# EAGLE design simple ladder filter (EAGLE 9.6.2)
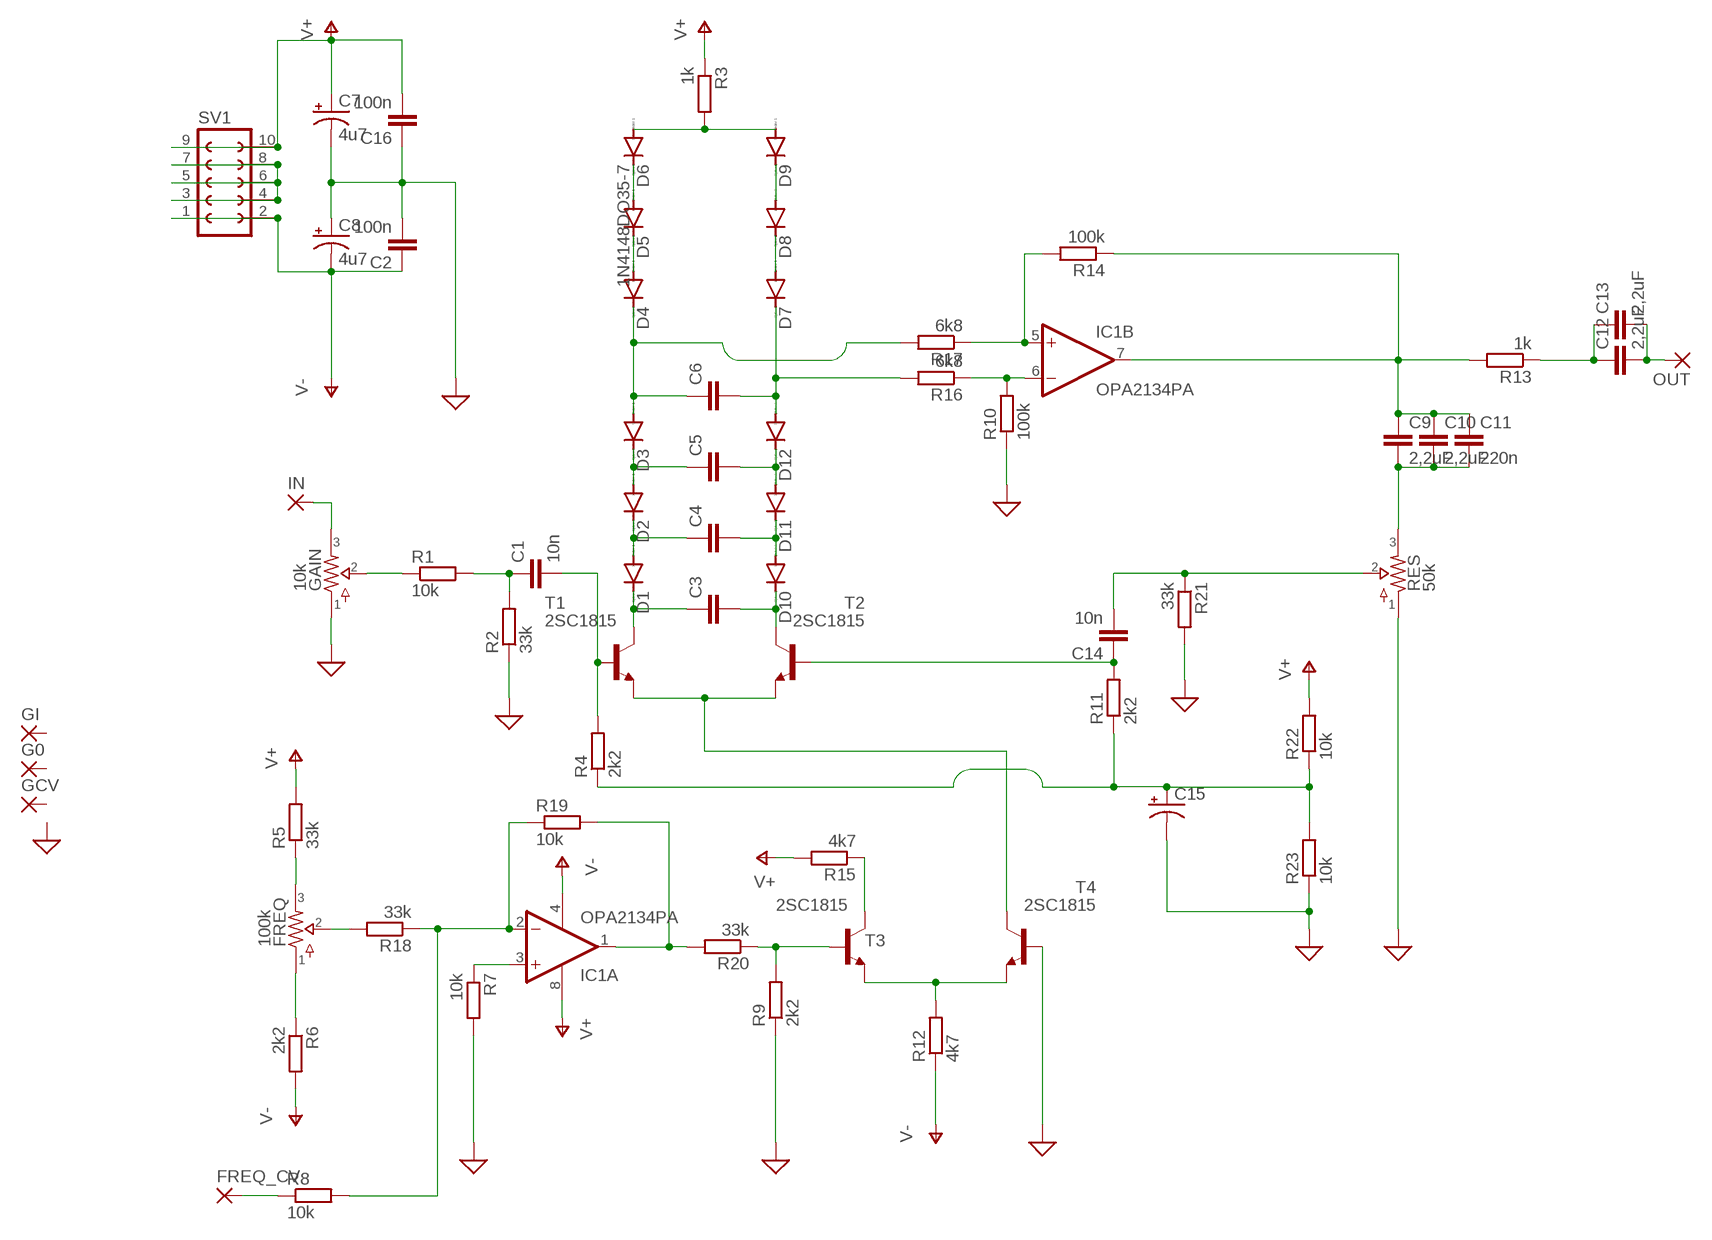
[diagram p0: schematic, sheet 1]

## Parts
C1  10n  C5/3  [C5B3]
C2  100n  C5/3  [C5B3]
C3  C2.5/2  [C2.5-2]
C4  C2.5/2  [C2.5-2]
C5  C2.5/2  [C2.5-2]
C6  C2.5/2  [C2.5-2]
C7  4u7  CPOL-USE2-4  [E2-4]
C8  4u7  CPOL-USE2-4  [E2-4]
C9  2,2uF  C5/5.5  [C5B5.5]
C10  2,2uF  C5/5.5  [C5B5.5]
C11  220n  C5/3  [C5B3]
C12  2,2uF  C5/5.5  [C5B5.5]
C13  2,2uF  C5/5.5  [C5B5.5]
C14  10n  C5/3  [C5B3]
C15  CPOL-USE2-4  [E2-4]
C16  100n  C5/3  [C5B3]
D1  1N4148DO35-7  [DO35-7]
D2  1N4148DO35-7  [DO35-7]
D3  1N4148DO35-7  [DO35-7]
D4  1N4148DO35-7  [DO35-7]
D5  1N4148DO35-7  [DO35-7]
D6  1N4148DO35-7  [DO35-7]
D7  1N4148DO35-7  [DO35-7]
D8  1N4148DO35-7  [DO35-7]
D9  1N4148DO35-7  [DO35-7]
D10  1N4148DO35-7  [DO35-7]
D11  1N4148DO35-7  [DO35-7]
D12  1N4148DO35-7  [DO35-7]
FREQ  100k  POTS9MM_VERT  [9MM_VERT]
FREQ_CV  1,6/0,9  [1,6/0,9]
G0  1,6/0,9  [1,6/0,9]
GAIN  10k  POTS9MM_VERT  [9MM_VERT]
GCV  1,6/0,9  [1,6/0,9]
GI  1,6/0,9  [1,6/0,9]
IC1  OPA2134PA  [DIL08]
IN  1,6/0,9  [1,6/0,9]
OUT  1,6/0,9  [1,6/0,9]
R1  10k  R-EU_0204/7  [0204/7]
R2  33k  R-EU_0204/7  [0204/7]
R3  1k  R-EU_0204/7  [0204/7]
R4  2k2  R-EU_0204/7  [0204/7]
R5  33k  R-EU_0204/7  [0204/7]
R6  2k2  R-EU_0204/7  [0204/7]
R7  10k  R-EU_0204/7  [0204/7]
R8  10k  R-EU_0204/7  [0204/7]
R9  2k2  R-EU_0204/7  [0204/7]
R10  100k  R-EU_0204/7  [0204/7]
R11  2k2  R-EU_0204/7  [0204/7]
R12  4k7  R-EU_0204/7  [0204/7]
R13  1k  R-EU_0204/7  [0204/7]
R14  100k  R-EU_0204/7  [0204/7]
R15  4k7  R-EU_0204/7  [0204/7]
R16  6k8  R-EU_0204/7  [0204/7]
R17  6k8  R-EU_0204/7  [0204/7]
R18  33k  R-EU_0204/7  [0204/7]
R19  10k  R-EU_0204/7  [0204/7]
R20  33k  R-EU_0204/7  [0204/7]
R21  33k  R-EU_0204/7  [0204/7]
R22  10k  R-EU_0204/7  [0204/7]
R23  10k  R-EU_0204/7  [0204/7]
RES  50k  POTS9MM_VERT  [9MM_VERT]
SV1  FE05-2  [FE05-2]
T1  2SC1815  [TO92-ECB]
T2  2SC1815  [TO92-ECB]
T3  2SC1815  [TO92-ECB]
T4  2SC1815  [TO92-ECB]

## Nets
GND: C2.2 C7.- C8.+ C15.- C16.1 GAIN.1 R2.1 R7.2 R9.1 R10.1 R21.2 R23.1 RES.1 T4.B ; supply symbol labelled SUP
N$1: GAIN.3 IN.1(P)
N$2: GAIN.2 R1.1
N$3: C1.1 R1.2 R2.2
N$4: C1.2 R4.2 T1.B
N$5: FREQ.3 R5.1
N$6: FREQ.1 R6.1
N$7: FREQ.2 R18.2
N$8: FREQ_CV.1(P) R8.1
N$9: IC1.2(A:-IN) R8.2 R18.1 R19.1
N$10: D7.A D8.C
N$11: C3.1 D1.C T1.C
N$12: C4.1 D1.A D2.C
N$13: C5.1 D2.A D3.C
N$14: C6.1 D3.A D4.C R17.2
N$15: D4.A D5.C
N$16: D5.A D6.C
N$17: D8.A D9.C
N$18: C6.2 D7.C D12.A R16.2
N$19: C5.2 D11.A D12.C
N$20: C4.2 D10.A D11.C
N$21: C3.2 D10.C T2.C
N$22: D6.A D9.A R3.2
N$23: IC1.3(A:+IN) R7.1
N$24: IC1.1(A:OUT) R19.2 R20.2
N$25: R9.2 R20.1 T3.B
N$26: R12.2 T3.E T4.E
N$27: IC1.6(B:-IN) R10.2 R16.1
N$28: T1.E T2.E T4.C
N$29: R15.1 T3.C
N$30: IC1.5(B:+IN) R14.2 R17.1
N$31: C15.+ R4.1 R11.1 R22.1 R23.2
N$32: C12.1 C13.1 R13.1
N$33: C12.2 C13.2 OUT.1(P)
N$34: C9.1 C10.1 C11.1 IC1.7(B:OUT) R13.2 R14.1
N$35: C9.2 C10.2 C11.2 RES.3
N$36: C14.1 R11.2 T2.B
N$38: C14.2 R21.1 RES.2
N$41: SV1.3 SV1.4 SV1.5 SV1.6 SV1.7 SV1.8
V+: C7.+ C16.2 IC1.8(A:V+) R3.1 R5.2 R15.2 R22.2 SV1.9 SV1.10
V-: C2.1 C8.- IC1.4(A:V-) R6.2 R12.1 SV1.1 SV1.2
Unconnected: G0.1(P) GCV.1(P) GI.1(P)

## Library data of the parts
C1-C6 C9-C14 C16 = capacitor-wima:C: CAPACITOR naming: grid - package width
C7 C8 C15 = adafruit:CPOL-US: POLARIZED CAPACITOR, American symbol
D1-D12 = diode:1N4148: DIODE high speed (Philips)
FREQ GAIN RES = potentiometers:POTS
FREQ_CV G0 GCV GI IN OUT = Electric Roots wirepad large drill:1,6/0,9: THROUGH-HOLE PAD
IC1 = linear:OPA2*: Dual Operational Amplifier Low Power, Single-Supply, Rail-To-Rail Operational Amplifier Source: http://focus.ti.com/lit/ds/symlink/opa2345.pdf http://focus.ti.com .. opa241.pdf http://focus.ti.com/lit/ds/symlink/opa2134.pdf
R1-R23 = rcl:R-EU_: RESISTOR, European symbol; SPICEPREFIX: R
SV1 = con-lsta:FE05-2: FEMALE HEADER; OC_FARNELL: unknown; OC_NEWARK: unknown
T1-T4 = transistor:2SC1815: NPN EPITAXIAL TRANSISTOR Source: TOSHIBA .. 2SC1815 1.pdf

## Board
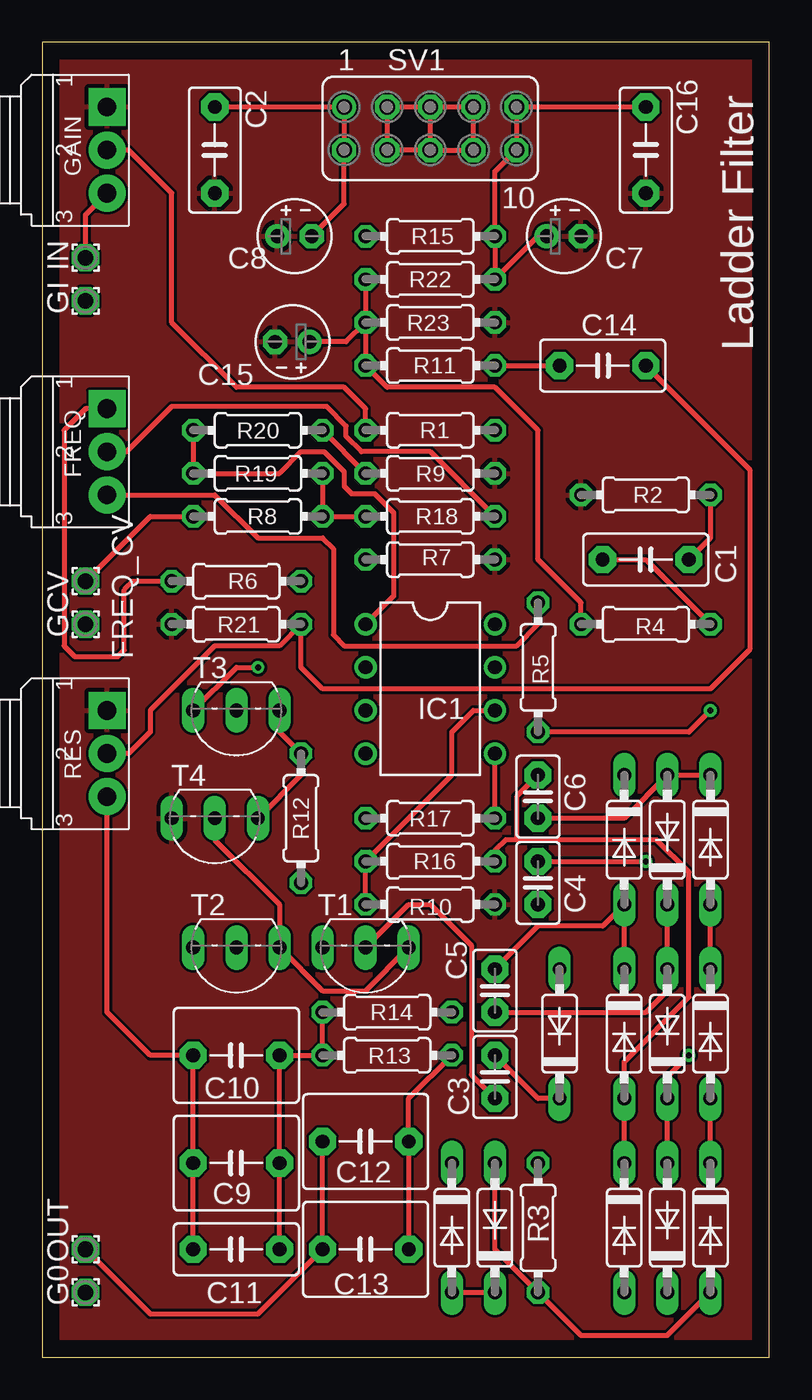
[diagram p1: board, top side]
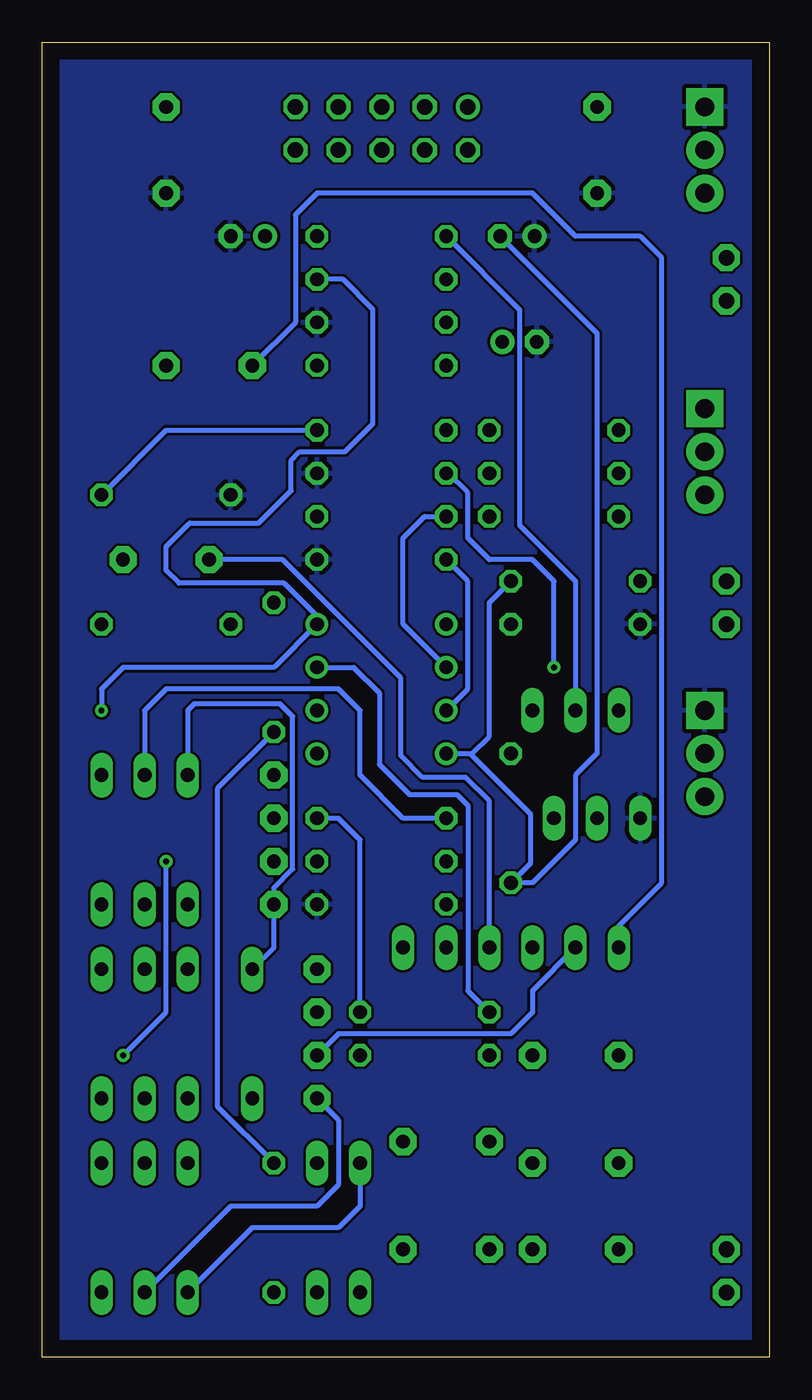
[diagram p2: board, bottom side, seen from below]

Size 42.85 x 77.46 mm. Coordinates in mm from the lower left corner, seen from the top.
Outline: 0,0 42.85,0 42.85,77.46 0,77.46 0,0
Copper layers (1*16): Top 0.035mm / dielectric 1.5mm / Bottom 0.035mm
Design rules "default": minimum track width 6mil, minimum drill 0.35mm, track to track 6mil, track to pad 6mil, pad to pad 6mil, via to via 6mil, smd to smd 6mil, copper to edge 40mil, drill to drill 6mil, minimum pad ring 10mil, minimum via ring 8mil, stop-mask expansion 4mil, vias tented up to drill 0mil, thermal gap 10mil

### Footprints (pad centres in the part's own frame; a part is rotated, then mirrored left to right if it is on the bottom)
C5B3 = drill 0.813 pad 1.6 octagon: 1 -2.54,0; 2 2.54,0
C2.5-2 = drill 0.813 pad 1.6 octagon: 1 -1.27,0; 2 1.27,0
E2-4 = drill 0.813 pad 1.422: + -1.016,0 | drill 0.813 pad 1.422 octagon: - 1.016,0
C5B5.5 = drill 0.813 pad 1.6 octagon: 1 -2.54,0; 2 2.54,0
DO35-7 = drill 0.813 long: A 3.81,0; C -3.81,0
9MM_VERT = drill 1.1 pad 2.184 square: 1 2.54,0 | drill 1.1 pad 2.184: 2 0,0; 3 -2.54,0
1,6/0,9 = drill 0.914 pad 1.6 octagon: 1 0,0
DIL08 = drill 0.813 pad 1.27: 1 -3.81,-3.81; 2 -1.27,-3.81; 3 1.27,-3.81; 4 3.81,-3.81; 5 3.81,3.81; 6 1.27,3.81; 7 -1.27,3.81; 8 -3.81,3.81
0204/7 = drill 0.813 octagon: 1 -3.81,0; 2 3.81,0
FE05-2 = drill 0.914: 1 -5.08,1.27 | drill 0.914 octagon: 2 -5.08,-1.27; 3 -2.54,1.27; 4 -2.54,-1.27; 5 0,1.27; 6 0,-1.27; 7 2.54,1.27; 8 2.54,-1.27; 9 5.08,1.27; 10 5.08,-1.27
TO92-ECB = drill 0.813 long: B 2.54,0; C 0,0; E -2.54,0

### Placement (x,y rotation side)
C1  35.56,46.99 180 top
C2  10.16,71.12 270 top
C3  26.67,16.51 90 top
C4  29.21,27.94 270 top
C5  26.67,21.59 90 top
C6  29.21,33.02 90 top
C7  30.73,66.04 0 top
C8  14.86,66.04 0 top
C9  11.43,11.43 180 top
C10  11.43,17.78 180 top
C11  11.43,6.35 180 top
C12  19.05,12.7 180 top
C13  19.05,6.35 180 top
C14  33.02,58.42 0 top
C15  14.73,59.82 180 top
C16  35.56,71.12 90 top
D1  36.83,7.62 90 top
D2  36.83,19.05 90 top
D3  36.83,30.48 90 top
D4  39.37,30.48 270 top
D5  39.37,19.05 270 top
D6  39.37,7.62 270 top
D7  34.29,7.62 270 top
D8  24.13,7.62 270 top
D9  26.67,7.62 90 top
D10  30.48,19.05 90 top
D11  34.29,30.48 270 top
D12  34.29,19.05 270 top
FREQ  3.81,53.34 90 top
FREQ_CV  2.54,45.72 0 top
G0  2.54,3.81 90 top
GAIN  3.81,71.12 90 top
GCV  2.54,43.18 0 top
GI  2.54,62.23 90 top
IC1  22.86,39.37 270 top
IN  2.54,64.77 0 top
OUT  2.54,6.35 0 top
R1  22.86,54.61 0 top
R2  35.56,50.8 0 top
R3  29.21,7.62 270 top
R4  35.56,43.18 0 top
R5  29.21,40.64 270 top
R6  11.43,45.72 0 top
R7  22.86,46.99 0 top
R8  12.7,49.53 0 top
R9  22.86,52.07 180 top
R10  22.86,26.67 180 top
R11  22.86,58.42 0 top
R12  15.24,31.75 90 top
R13  20.32,17.78 180 top
R14  20.32,20.32 0 top
R15  22.86,66.04 0 top
R16  22.86,29.21 0 top
R17  22.86,31.75 180 top
R18  22.86,49.53 0 top
R19  12.7,52.07 180 top
R20  12.7,54.61 180 top
R21  11.43,43.18 180 top
R22  22.86,63.5 0 top
R23  22.86,60.96 180 top
RES  3.81,35.56 90 top
SV1  22.86,72.39 0 top
T1  19.05,24.13 180 top
T2  11.43,24.13 180 top
T3  11.43,38.1 180 top
T4  10.16,31.75 180 top

### Tracks (layer width: path | path; a pad name or v marks a point on that pad's centre or on a via)
GND
  pour Top: -6.35,92.71 -6.35,-25.4 57.15,-25.4 57.15,92.71 49.53,100.33 1.27,100.33
  pour Bottom: -2.54,99.06 0,99.06 2.54,101.6 55.88,101.6 66.04,91.44 66.04,-20.32 -5.08,-20.32 -6.35,-19.05 -6.35,93.98 -2.54,97.79
N$1
  Top 0.305: IN.1 2.54,67.31 GAIN.3
N$2
  Top 0.305: GAIN.2 5.08,71.12 7.62,68.58 7.62,60.96 11.43,57.15 17.78,57.15 19.05,55.88 R1.1
N$3
  Top 0.305: R2.2 39.37,48.26 C1.1
  Bottom 0.305: R2.2 35.56,54.61 R1.2
N$4
  Top 0.305: C1.2 35.56,46.99 R4.2
  Bottom 0.305: T1.B 16.51,32.77 17.91,34.16 20.45,34.16 21.72,35.43 21.72,40 28.7,46.99 C1.2
N$5
  Top 0.305: FREQ.3 10.16,50.8 12.7,48.26 16.51,48.26 17.14,47.62 17.14,42.55 17.78,41.91 27.94,41.91 29.21,43.18 R5.1
N$6
  Top 0.305: FREQ.1 2.54,55.88 1.27,54.61 1.27,41.91 1.91,41.28 4.45,41.28 4.83,41.66 4.83,45.21 5.33,45.72 R6.1
N$7
  Top 0.305: R18.2 22.86,53.34 18.8,53.34 17.91,54.23 17.91,54.86 16.76,56.01 7.62,56.01 4.95,53.34 FREQ.2
N$8
  Top 0.305: FREQ_CV.1 6.35,49.53 R8.1
N$9
  Top 0.305: R19.1 R8.2 R18.1
  Bottom 0.305: IC1.2 21.59,43.18 21.59,48.26 20.32,49.53 R18.1
N$10
  Bottom 0.305: D8.C 24.13,8.89 25.4,7.62 30.48,7.62 D7.A
N$11
  Top 0.305: T1.C 21.59,26.67 22.86,26.67 25.27,24.26 25.27,16.64 C3.1
  Bottom 0.305: D1.C 31.75,8.89 26.67,8.89 25.4,10.16 25.4,13.97 C3.1
N$12  (via drill 0.35)
  Top 0.305: D1.A D2.C 36.83,16.51 v38.1,17.78 | C4.1 v35.56,29.21
  Bottom 0.305: v38.1,17.78 35.56,20.32 v35.56,29.21
N$13
  Top 0.305: D3.C D2.A 36.83,21.59 35.56,20.32 C5.1
N$14
  Top 0.305: D4.C D3.A 34.29,31.75 C6.1
  Bottom 0.305: R17.2 21.59,31.75 24.13,34.29 24.13,38.1 25.4,39.37 35.56,39.37 36.83,38.1 D3.A
N$15
  Top 0.305: D5.C D4.A
N$16
  Top 0.305: D6.C D5.A
N$17
  Top 0.305: D8.A D9.C
N$18
  Top 0.305: D7.C D12.A 34.29,17.4 38.1,21.21 38.1,28.57 36.2,30.48 27.94,30.48 | 27.94,30.48 27.3,30.48 26.67,29.85 R16.2 | C6.2 27.94,33.02 27.94,30.48
N$19
  Top 0.305: D12.C D11.A 33.02,25.4 29.21,25.4 C5.2
N$20
  Bottom 0.305: D10.A 29.21,24.13 C4.2 29.21,27.65 28.11,28.75 28.11,37.76 28.83,38.48 33.91,38.48 34.29,38.1 D11.C
N$21
  Top 0.305: D10.C 29.21,15.24 C3.2
  Bottom 0.305: T2.C 13.97,21.59 13.97,20.32 15.24,19.05 25.4,19.05 C3.2
N$22
  Top 0.305: D9.A 26.67,6.35 R3.2 31.75,1.27 36.83,1.27 D6.A
N$23
  Bottom 0.305: IC1.3 17.78,39.37 17.78,45.72 R7.1
N$24
  Top 0.305: R20.2 R19.2 13.97,52.07 15.24,53.34 16.61,53.34 17.78,52.17 17.78,51.31 18.21,50.88 19.58,50.88 20.7,49.75 20.7,44.83 IC1.1
N$25  (via drill 0.35)
  Top 0.305: R9.2 R20.1 | T3.B 11.43,40.64 v12.7,40.64
  Bottom 0.305: v12.7,40.64 12.7,45.72 13.97,46.99 16.51,46.99 17.78,48.26 17.78,50.93 18.92,52.07 R9.2
N$26
  Top 0.305: T3.E 13.97,36.83 R12.2 15.24,34.29 T4.E
N$27
  Top 0.305: R10.2 R16.1 24.13,34.29 24.13,36.83 25.4,38.1 IC1.6
N$28
  Top 0.305: T4.C 10.16,30.48 13.97,26.67 T2.E 16.51,21.59 19.05,21.59 T1.E
N$29
  Bottom 0.305: R15.1 14.73,61.72 14.73,49.02 11.43,45.72 T3.C
N$30
  Top 0.305: R17.1 IC1.5
  Bottom 0.305: R14.2 24.13,30.48 25.4,31.75 R17.1
N$31
  Top 0.305: R22.1 R23.2 | R23.2 R11.1 20.32,57.15 26.67,57.15 29.21,54.61 29.21,46.99 31.75,44.45 R4.1 | R23.2 17.91,59.82 C15.+
N$32
  Top 0.305: C13.1 C12.1 21.59,15.24 R13.1
N$33
  Top 0.305: OUT.1 6.35,2.54 12.7,2.54 C13.2 C12.2
N$34
  Top 0.305: C11.1 C9.1 C10.1 R13.2 R14.1
  Bottom 0.305: IC1.7 24.51,40.64 22.99,39.12 22.99,34.92 21.21,33.15 18.41,33.15 17.78,32.51 17.78,21.59 R14.1
N$35
  Top 0.305: C11.2 C9.2 C10.2 6.35,17.78 3.81,20.32 RES.3
N$36
  Top 0.305: R11.2 C14.1
  Bottom 0.305: T2.B 8.89,25.4 6.35,27.94 6.35,64.77 7.62,66.04 11.43,66.04 13.97,68.58 26.67,68.58 27.94,67.31 27.94,60.96 C14.1
N$38
  Top 0.305: C14.2 41.68,52.3 41.68,41.68 39.37,39.37 16.51,39.37 15.24,40.64 R21.1 13.97,41.91 10.16,41.91 6.35,38.1 6.35,36.83 5.08,35.56 RES.2
N$41
  Top 0.305: SV1.6 SV1.4 SV1.3 SV1.5 | SV1.5 SV1.7 SV1.8 SV1.6 | SV1.6 SV1.5
V+  (via drill 0.35)
  Top 0.305: C16.2 SV1.9 SV1.10 26.67,69.85 R15.2 R22.2 29.21,66.04 C7.+ | v39.37,38.1 38.1,36.83 R5.2
  Bottom 0.305: R3.1 32.51,14.73 32.51,33.53 R5.2 | v39.37,38.1 39.37,39.37 38.1,40.64 29.21,40.64 IC1.8 26.67,43.66 28.61,45.59 34.8,45.59 35.56,46.36 35.56,47.75 34.16,49.15 30.1,49.15 28.19,51.05 28.19,52.83 27.69,53.34 25.02,53.34 23.37,54.99 23.37,61.72 25.15,63.5 R22.2
V-
  Top 0.305: C2.1 SV1.1 SV1.2 17.78,67.95 C8.-
  Bottom 0.305: C8.- 10.16,60.33 10.16,35.56 11.43,34.29 11.43,30.48 13.97,27.94 R12.1 14.1,29.08 14.1,32 17.65,35.56 IC1.4 17.53,35.56 16.51,36.58 16.51,44.45 R6.2

### Text on the board
tPlace: Ladder Filter | R3
tNames: pin 10 = +